# EAGLE schematic Module_20200511_0_scoreBoard (EAGLE 9.3.2)
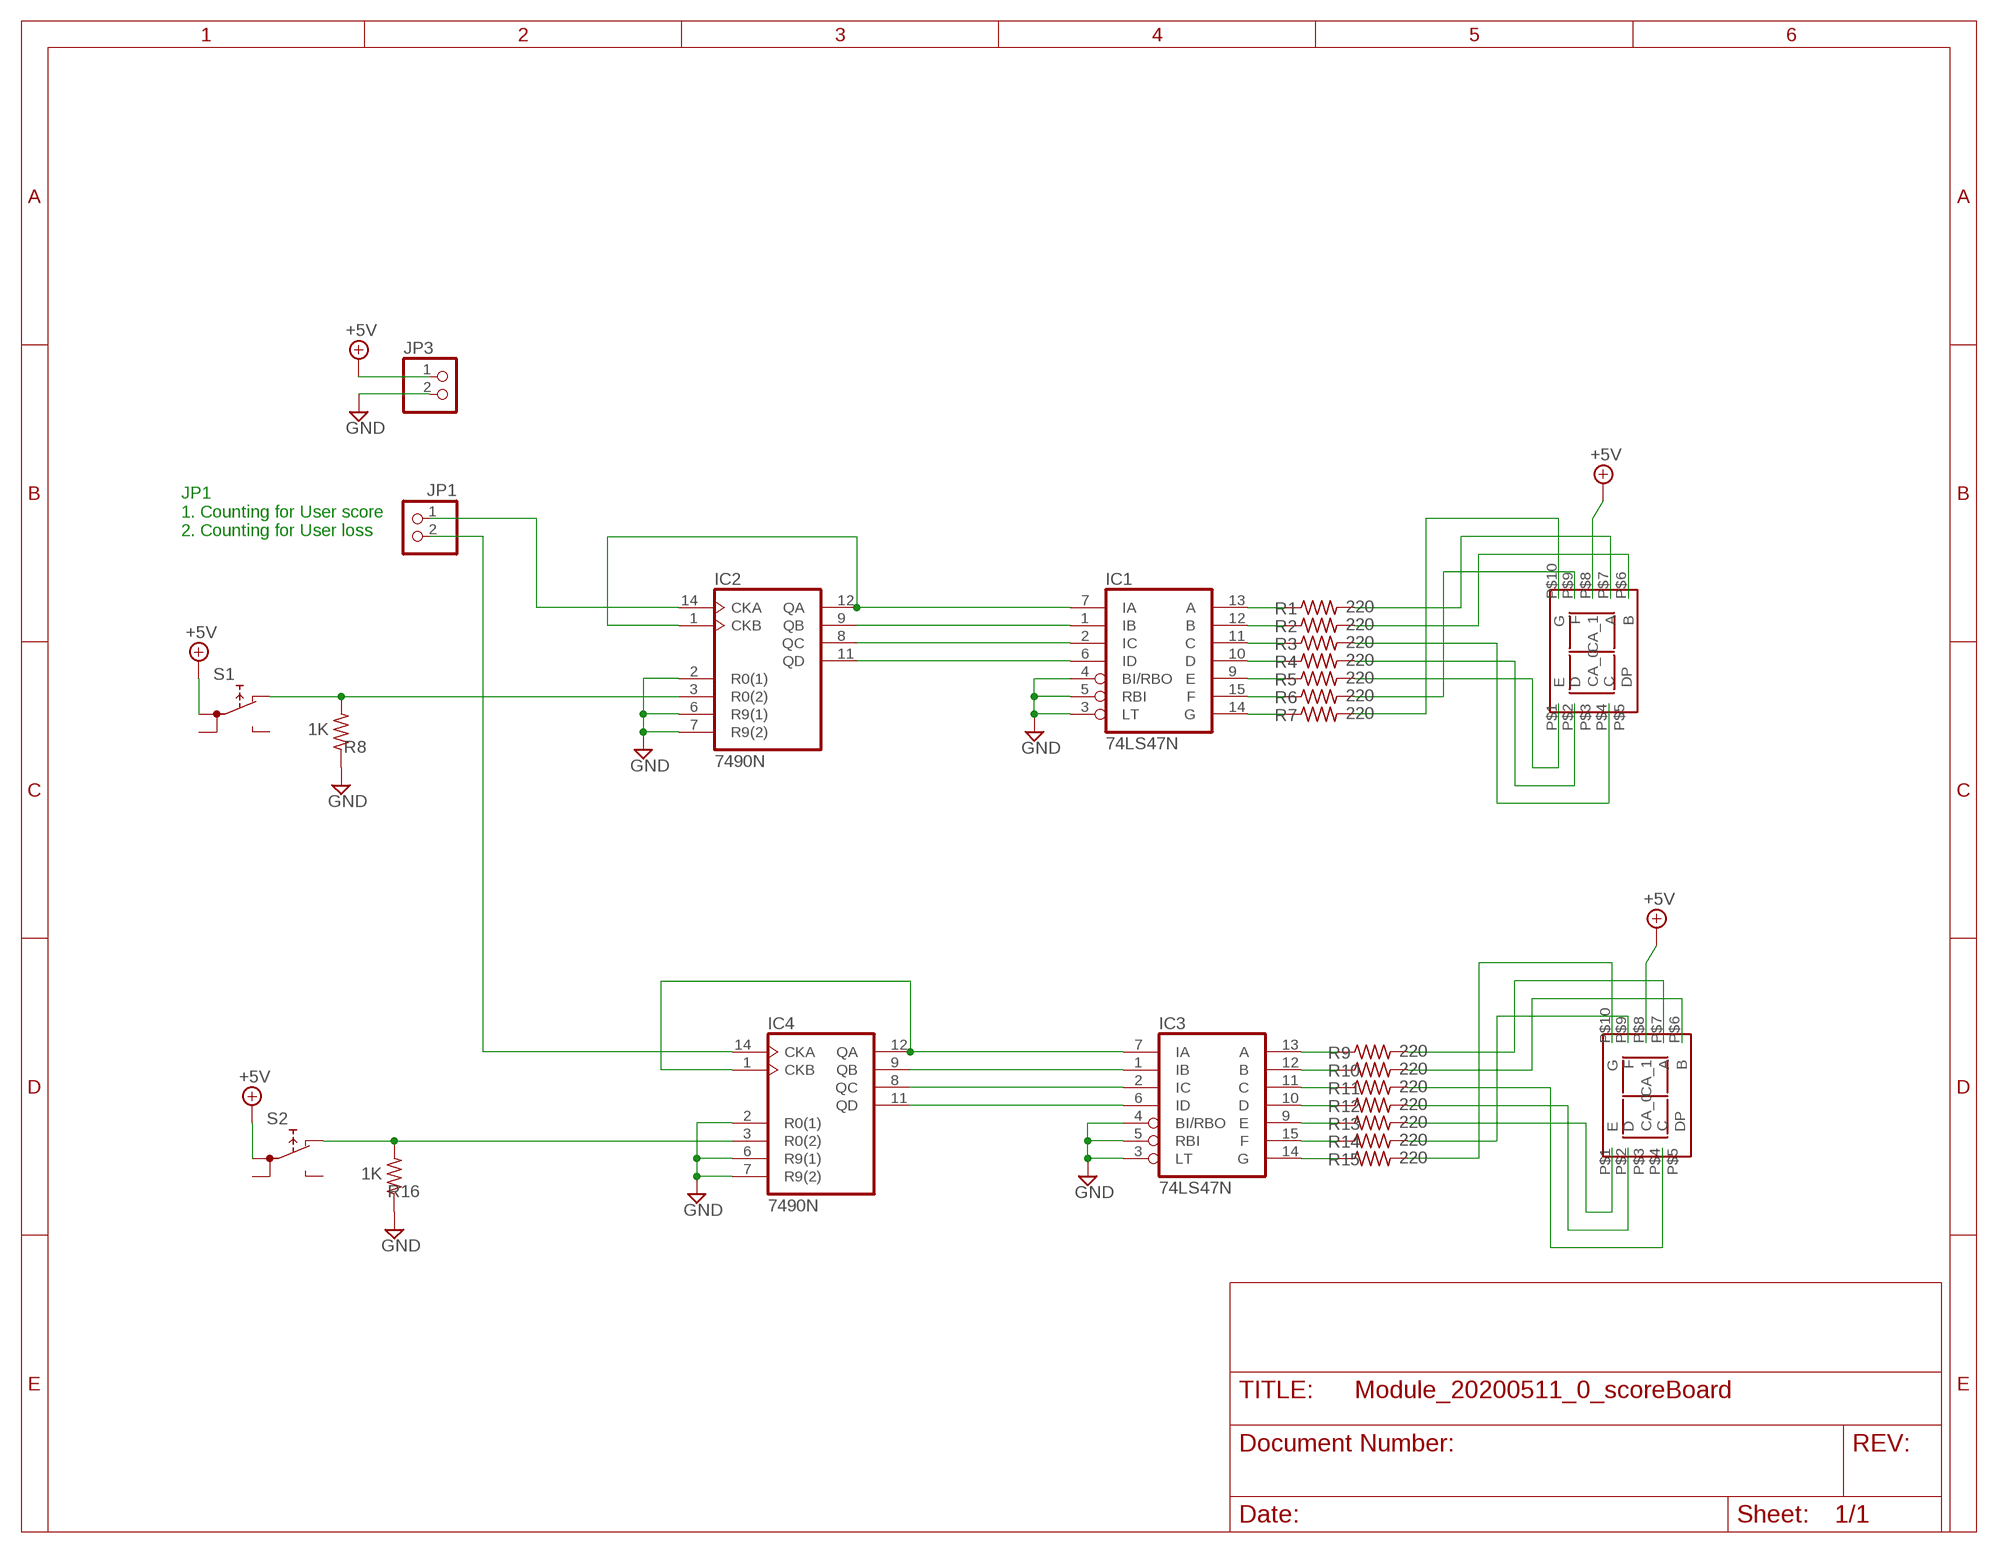
[diagram p0: schematic, sheet 1]

## Parts
IC1  74LS47N  [DIL16]
IC2  7490N  [DIL14]
IC3  74LS47N  [DIL16]
IC4  7490N  [DIL14]
JP1  PINHD-1X2  [1X02]
JP3  PINHD-1X2  [1X02]
R1  220  R-US_0207/12  [0207/12]
R2  220  R-US_0207/12  [0207/12]
R3  220  R-US_0207/12  [0207/12]
R4  220  R-US_0207/12  [0207/12]
R5  220  R-US_0207/12  [0207/12]
R6  220  R-US_0207/12  [0207/12]
R7  220  R-US_0207/12  [0207/12]
R8  1K  R-US_0204/7  [0204/7]
R9  220  R-US_0207/12  [0207/12]
R10  220  R-US_0207/12  [0207/12]
R11  220  R-US_0207/12  [0207/12]
R12  220  R-US_0207/12  [0207/12]
R13  220  R-US_0207/12  [0207/12]
R14  220  R-US_0207/12  [0207/12]
R15  220  R-US_0207/12  [0207/12]
R16  1K  R-US_0204/7  [0204/7]
S1  5511  [5511]
S2  5511  [5511]
U$1  CSS-516E  [CSS-516E]
U$2  CSS-516E  [CSS-516E]

## Nets
+5V: JP3.1 S1.1A S2.1A U$1.P$8(CA_1) U$2.P$8(CA_1)
GND: IC1.3(LT) IC1.4(BI/RBO) IC1.5(RBI) IC2.2(R0(1)) IC2.6(R9(1)) IC2.7(R9(2)) IC3.3(LT) IC3.4(BI/RBO) IC3.5(RBI) IC4.2(R0(1)) IC4.6(R9(1)) IC4.7(R9(2)) JP3.2 R8.1 R16.1
N$1: IC1.13(A) R1.1
N$2: IC1.12(B) R2.1
N$3: IC1.11(C) R3.1
N$4: IC1.10(D) R4.1
N$5: IC1.9(E) R5.1
N$6: IC1.15(F) R6.1
N$7: IC1.14(G) R7.1
N$8: R1.2 U$1.P$7(A)
N$9: R2.2 U$1.P$6(B)
N$10: R3.2 U$1.P$4(C)
N$11: R4.2 U$1.P$2(D)
N$12: R5.2 U$1.P$1(E)
N$13: R6.2 U$1.P$9(F)
N$14: R7.2 U$1.P$10(G)
N$15: IC1.7(IA) IC2.1(CKB) IC2.12(QA)
N$16: IC1.1(IB) IC2.9(QB)
N$17: IC1.2(IC) IC2.8(QC)
N$18: IC1.6(ID) IC2.11(QD)
N$19: IC4.3(R0(2)) R16.2 S2.NC
N$20: IC2.14(CKA) JP1.1
N$21: IC3.13(A) R9.1
N$22: IC3.12(B) R10.1
N$23: IC3.11(C) R11.1
N$24: IC3.10(D) R12.1
N$25: IC3.9(E) R13.1
N$26: IC3.15(F) R14.1
N$27: IC3.14(G) R15.1
N$28: R9.2 U$2.P$7(A)
N$29: R10.2 U$2.P$6(B)
N$30: R11.2 U$2.P$4(C)
N$31: R12.2 U$2.P$2(D)
N$32: R13.2 U$2.P$1(E)
N$33: R14.2 U$2.P$9(F)
N$34: IC3.7(IA) IC4.1(CKB) IC4.12(QA)
N$35: IC3.1(IB) IC4.9(QB)
N$36: IC3.2(IC) IC4.8(QC)
N$37: IC3.6(ID) IC4.11(QD)
N$38: R15.2 U$2.P$10(G)
N$39: IC2.3(R0(2)) R8.2 S1.NC
N$40: IC4.14(CKA) JP1.2
Unconnected: S1.1B S1.NO S2.1B S2.NO U$1.P$5(DP) U$2.P$5(DP)

## Notes on the sheet
- JP1
  1. Counting for User score
  2. Counting for User loss

## Power pins joined to a net without a drawn wire
CA_0: U$1.P$3(CA_0) U$2.P$3(CA_0)
GND: IC1.8(GND) IC2.10(GND) IC3.8(GND) IC4.10(GND)
VCC: IC1.16(VCC) IC2.5(VCC) IC3.16(VCC) IC4.5(VCC)

## Library data of the parts
IC1 IC3 = 74xx-eu:74*47: BCD to seven segment DECODER/DRIVER Source: http://www.ee.washington.edu/stores/DataSheets/74ls/74ls47.pdf
IC2 IC4 = 74xx-eu:74*90: Decade, divide by twelve and binary COUNTER
JP1 JP3 = pinhead:PINHD-1X2: PIN HEADER
R1-R16 = rcl:R-US_: RESISTOR, American symbol; SPICEPREFIX: R
S1 S2 = switch:55?: PUSHBUTTON SERIES 5500 SWITCHES Source: www.e-switch.com .. 5500.pdf
U$1 U$2 = CSS_516E:CSS-516E